# Altium schematic sheet Sheet5_RevHistory.SchDoc
size B; CompanyName: Microchip Technology Inc.; Organization: Microchip Technology; Address1: 2355 West Chandler Blvd.; Address2: Chandler, AZ  85224; Address4: USA; DocumentNumber: 5; SheetNumber: 5; SheetTotal: 5; SheetTitle: Revision History; Time: Time
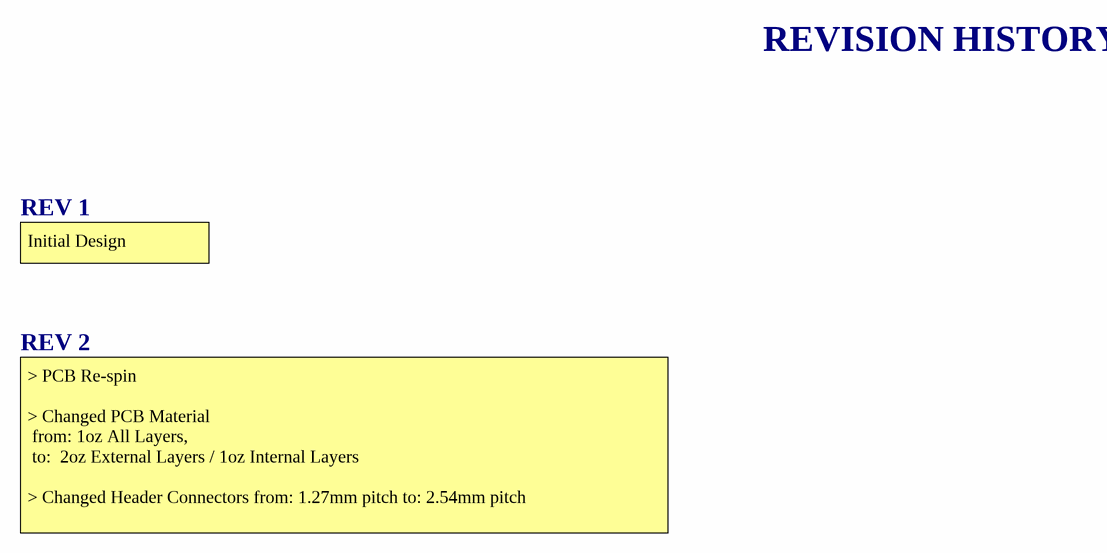
[diagram p0: Sheet5_RevHistory.SchDoc]

## Notes on the sheet
- REVISION HISTORY
- REV 1
- Initial Design
- REV 2
- > PCB Re-spin
  > Changed PCB Material
  from: 1oz All Layers,
  to:  2oz External Layers / 1oz Internal Layers
  > Changed Header Connectors from: 1.27mm pitch to: 2.54mm pitch
- Project Owner:
- PCB Layout Contact:
- PartNumber:
- Project Title
- Variant:
- Sheet Title
- Size
- B
- SCH #:
- PCB #:
- Rev:
- Date:
- Sheet
- Designed with
- Altium.com <http://go.altium.com/MicrochipLandingPage_Evaluation.html>
- File: